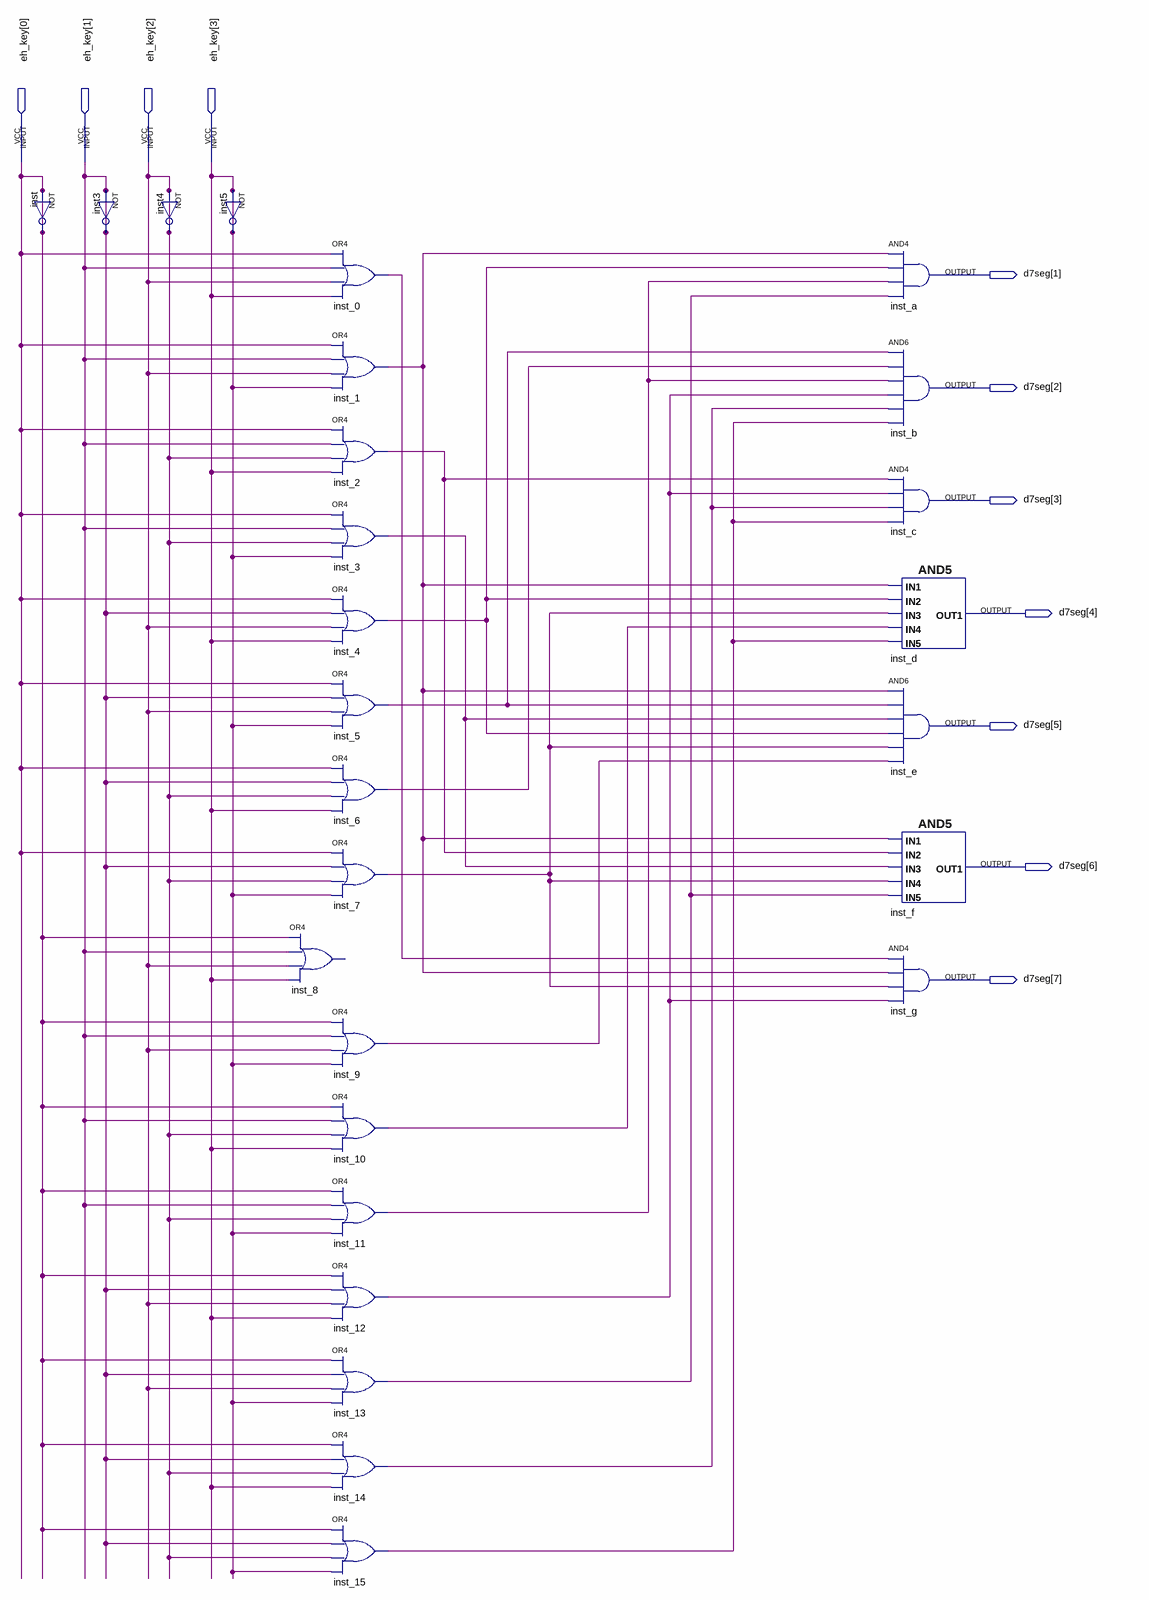
[diagram p0: schematic sheet]
// Quartus schematic Block1.bdf as structural Verilog: 27 symbols, 11 pins
module Block1 (
  input  [3:0] eh_key,
  output [7:1] d7seg
);

  wire inst_0_out, inst_1_out, inst_2_out, inst_3_out, inst_4_out, inst_5_out, inst_6_out, inst_7_out,
       inst_9_out, inst_10_out, inst_11_out, inst_12_out, inst_13_out, inst_14_out, inst_15_out;

  not inst (eh_key[0], eh_key[0]);
  not inst3 (eh_key[1], eh_key[1]);
  not inst4 (eh_key[2], eh_key[2]);
  not inst5 (eh_key[3], eh_key[3]);
  // OR4 inst_8 has open pins: IN1=eh_key[0], IN2=eh_key[1], IN3=eh_key[2], IN4=eh_key[3], OUT=open
  or inst_0 (inst_0_out, eh_key[0], eh_key[1], eh_key[2], eh_key[3]);
  or inst_1 (inst_1_out, eh_key[0], eh_key[1], eh_key[2], eh_key[3]);
  or inst_2 (inst_2_out, eh_key[0], eh_key[1], eh_key[2], eh_key[3]);
  or inst_3 (inst_3_out, eh_key[0], eh_key[1], eh_key[2], eh_key[3]);
  or inst_4 (inst_4_out, eh_key[0], eh_key[1], eh_key[2], eh_key[3]);
  or inst_5 (inst_5_out, eh_key[0], eh_key[1], eh_key[2], eh_key[3]);
  or inst_6 (inst_6_out, eh_key[0], eh_key[1], eh_key[2], eh_key[3]);
  or inst_7 (inst_7_out, eh_key[0], eh_key[1], eh_key[2], eh_key[3]);
  or inst_9 (inst_9_out, eh_key[0], eh_key[1], eh_key[2], eh_key[3]);
  or inst_10 (inst_10_out, eh_key[0], eh_key[1], eh_key[2], eh_key[3]);
  or inst_11 (inst_11_out, eh_key[0], eh_key[1], eh_key[2], eh_key[3]);
  or inst_12 (inst_12_out, eh_key[0], eh_key[1], eh_key[2], eh_key[3]);
  or inst_13 (inst_13_out, eh_key[0], eh_key[1], eh_key[2], eh_key[3]);
  or inst_14 (inst_14_out, eh_key[0], eh_key[1], eh_key[2], eh_key[3]);
  or inst_15 (inst_15_out, eh_key[0], eh_key[1], eh_key[2], eh_key[3]);
  and inst_a (d7seg[1], inst_1_out, inst_4_out, inst_11_out, inst_13_out);
  and inst_b (d7seg[2], inst_5_out, inst_6_out, inst_11_out, inst_12_out, inst_14_out, inst_15_out);
  and inst_c (d7seg[3], inst_2_out, inst_12_out, inst_14_out, inst_15_out);
  AND5 inst_d (
    .IN3(inst_7_out), .IN2(inst_4_out), .IN1(inst_1_out), .IN5(inst_15_out), .IN4(inst_10_out),
    .OUT1(d7seg[4]));
  and inst_e (d7seg[5], inst_1_out, inst_5_out, inst_3_out, inst_4_out, inst_7_out, inst_9_out);
  AND5 inst_f (
    .IN3(inst_3_out), .IN2(inst_2_out), .IN1(inst_1_out), .IN5(inst_13_out), .IN4(inst_7_out), .OUT1(d7seg[6]));
  and inst_g (d7seg[7], inst_0_out, inst_1_out, inst_7_out, inst_12_out);
endmodule
